# EAGLE design fireboy_yun (EAGLE 7.5.0)
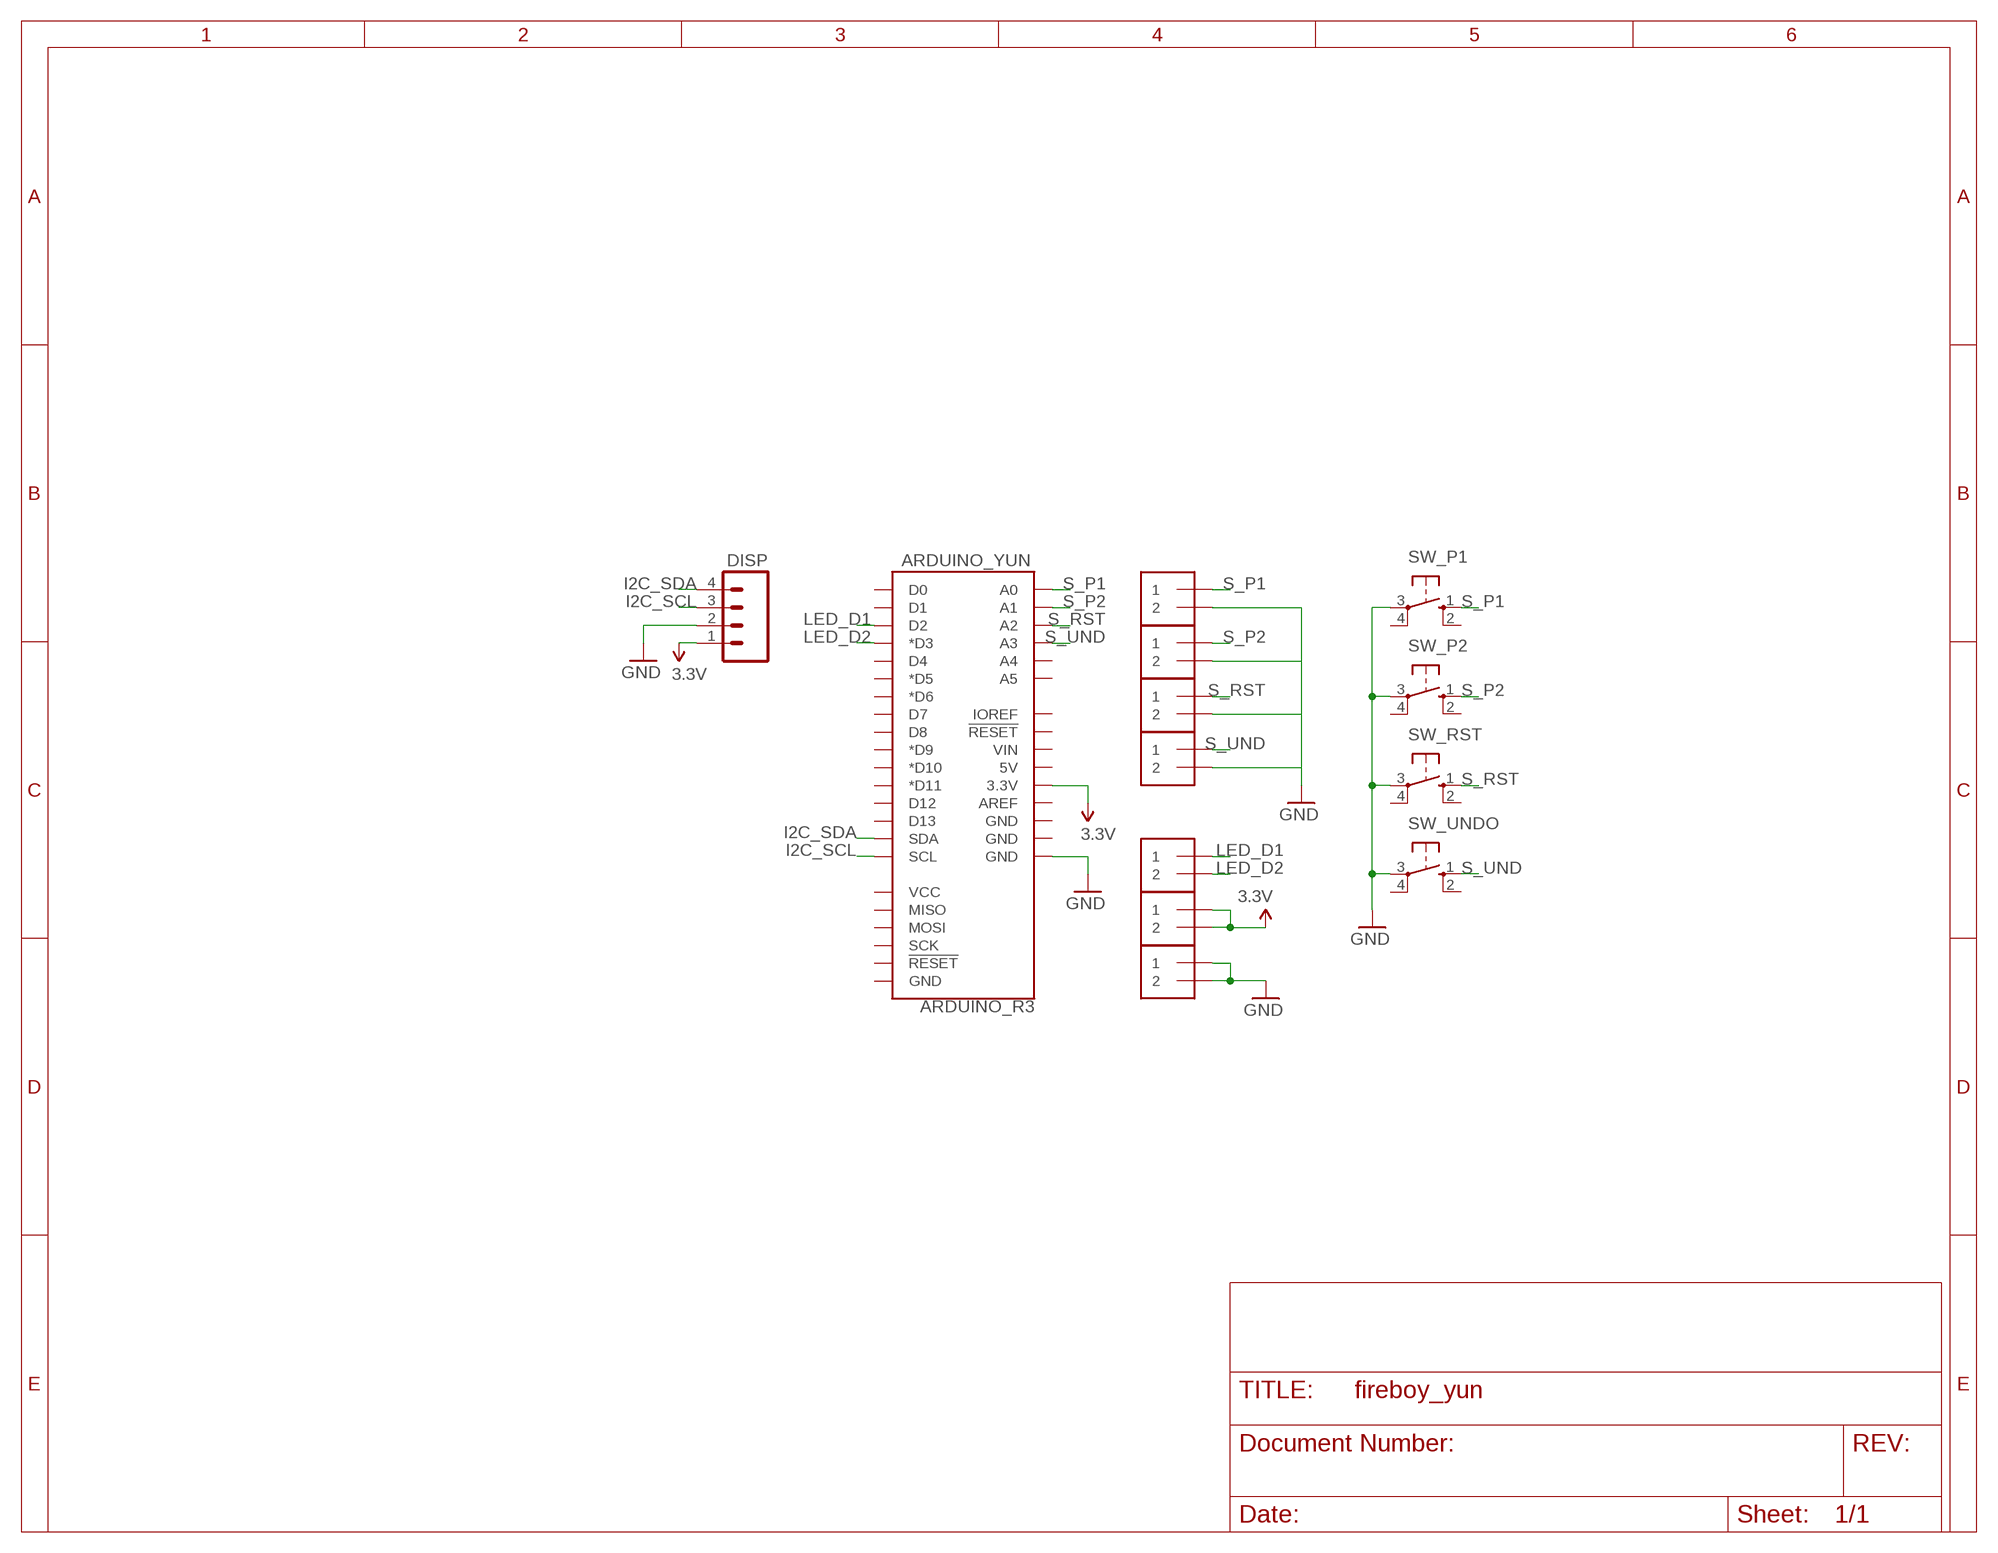
[diagram p0: schematic, sheet 1]

## Parts
ARDUINO_YUN  ARDUINO_R3  [ARDUINO_R3]
DISP  M04PTH  [1X04]
LED_3.3V  1X2-3.5MM  [1X2-3.5MM]
LED_DATA  1X2-3.5MM  [1X2-3.5MM]
LED_GND  1X2-3.5MM  [1X2-3.5MM]
S_P1  1X2-3.5MM  [1X2-3.5MM]
S_P2  1X2-3.5MM  [1X2-3.5MM]
S_RST  1X2-3.5MM  [1X2-3.5MM]
S_UND  1X2-3.5MM  [1X2-3.5MM]
SW_P1  40-XX  [B3F-40XX]
SW_P2  40-XX  [B3F-40XX]
SW_RST  40-XX  [B3F-40XX]
SW_UNDO  40-XX  [B3F-40XX]

## Nets
3.3V: ARDUINO_YUN.3.3V DISP.1 LED_3.3V.1 LED_3.3V.2
GND: ARDUINO_YUN.GND@2(GND) DISP.2 LED_GND.1 LED_GND.2 S_P1.2 SW_P1.3(P) SW_P2.3(P) SW_RST.3(P) SW_UNDO.3(P)
I2C_SCL: ARDUINO_YUN.SCL DISP.3
I2C_SDA: ARDUINO_YUN.SDA DISP.4
LED_D1: ARDUINO_YUN.D2 LED_DATA.1
LED_D2: ARDUINO_YUN.D3(*D3) LED_DATA.2
N$2: S_P2.2
N$3: S_RST.2
N$4: S_UND.2
S_P1: ARDUINO_YUN.A0 S_P1.1 SW_P1.1(S)
S_P2: ARDUINO_YUN.A1 S_P2.1
S_RST: ARDUINO_YUN.A2 S_RST.1
S_UND: ARDUINO_YUN.A3 S_UND.1
Unconnected: ARDUINO_YUN.5V ARDUINO_YUN.A4 ARDUINO_YUN.A5 ARDUINO_YUN.AREF ARDUINO_YUN.D0 ARDUINO_YUN.D1 ARDUINO_YUN.D4 ARDUINO_YUN.D5(*D5) ARDUINO_YUN.D6(*D6) ARDUINO_YUN.D7 ARDUINO_YUN.D8 ARDUINO_YUN.D9(*D9) ARDUINO_YUN.D10(*D10) ARDUINO_YUN.D11(*D11) ARDUINO_YUN.D12 ARDUINO_YUN.D13 ARDUINO_YUN.GND@1(GND) ARDUINO_YUN.GND@3(GND) ARDUINO_YUN.GND@4(GND) ARDUINO_YUN.IOREF ARDUINO_YUN.MISO ARDUINO_YUN.MOSI ARDUINO_YUN.RESET@1(!RESET!) ARDUINO_YUN.RESET@2(!RESET!) ARDUINO_YUN.SCK ARDUINO_YUN.VCC ARDUINO_YUN.VIN SW_P1.2(S1) SW_P1.4(P1) SW_P2.1(S) SW_P2.2(S1) SW_P2.4(P1) SW_RST.1(S) SW_RST.2(S1) SW_RST.4(P1) SW_UNDO.1(S) SW_UNDO.2(S1) SW_UNDO.4(P1)

## Library data of the parts
ARDUINO_YUN = SparkFun-Boards:ARDUINO_R3: Arduino R3 Footprint (w/ SPI header)
DISP = SparkFun-Connectors:M04: Header 4 Standard 4-pin 0.1" header. Use with straight break away headers (SKU : PRT-00116), right angle break away headers (PRT-00553), swiss pins (PRT-00743), machine pins (PRT-00117), and female headers (PRT-00115). Molex polarized connector foot print use with SKU : PRT-08231 with associated crimp pins and housings. 1MM SMD Version SKU: PRT-10208; PROD_ID: CONN-09696
LED_3.3V LED_DATA LED_GND S_P1 S_P2 S_RST S_UND = adafruit:1X2: 3.5mm Terminal block http://www.ladyada.net/library/pcb/eaglelibrary.html
SW_P1 SW_P2 SW_RST SW_UNDO = adafruit:40-XX: OMRON SWITCH; MF: OMRON COMPONENTS USA; MPN: B3F-4000; OC_FARNELL: 176434; OC_NEWARK: 36K3105

## Board
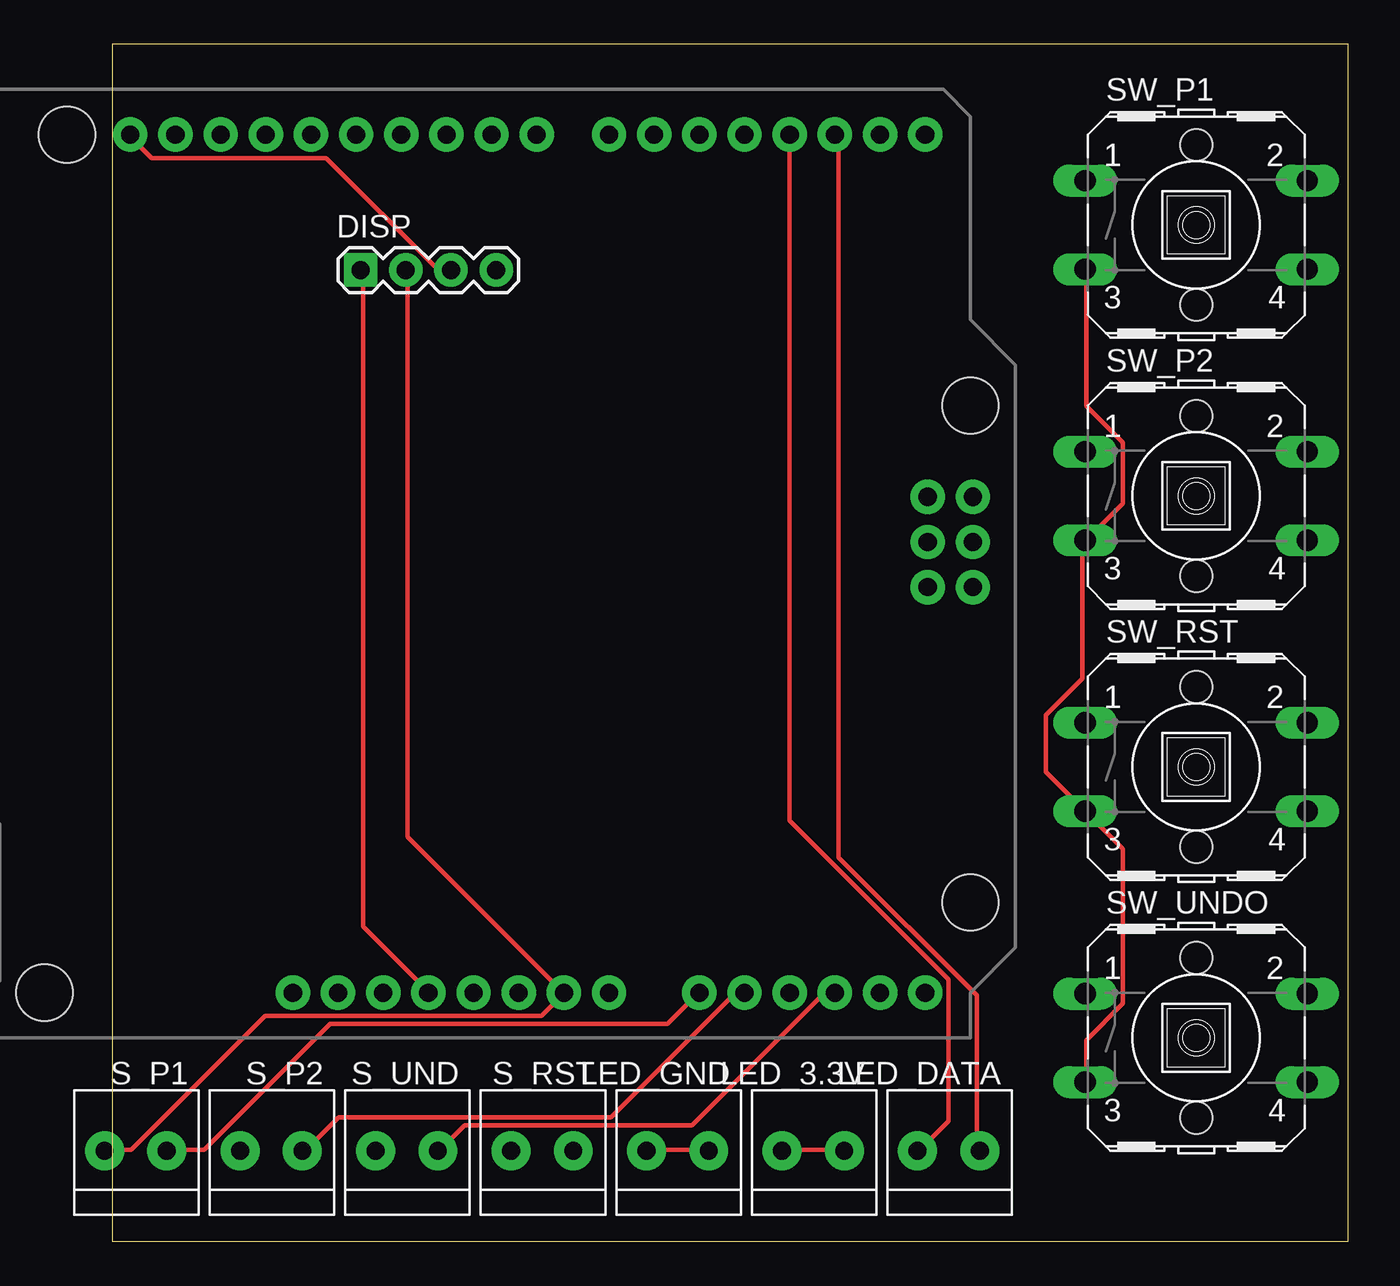
[diagram p1: board, top side]
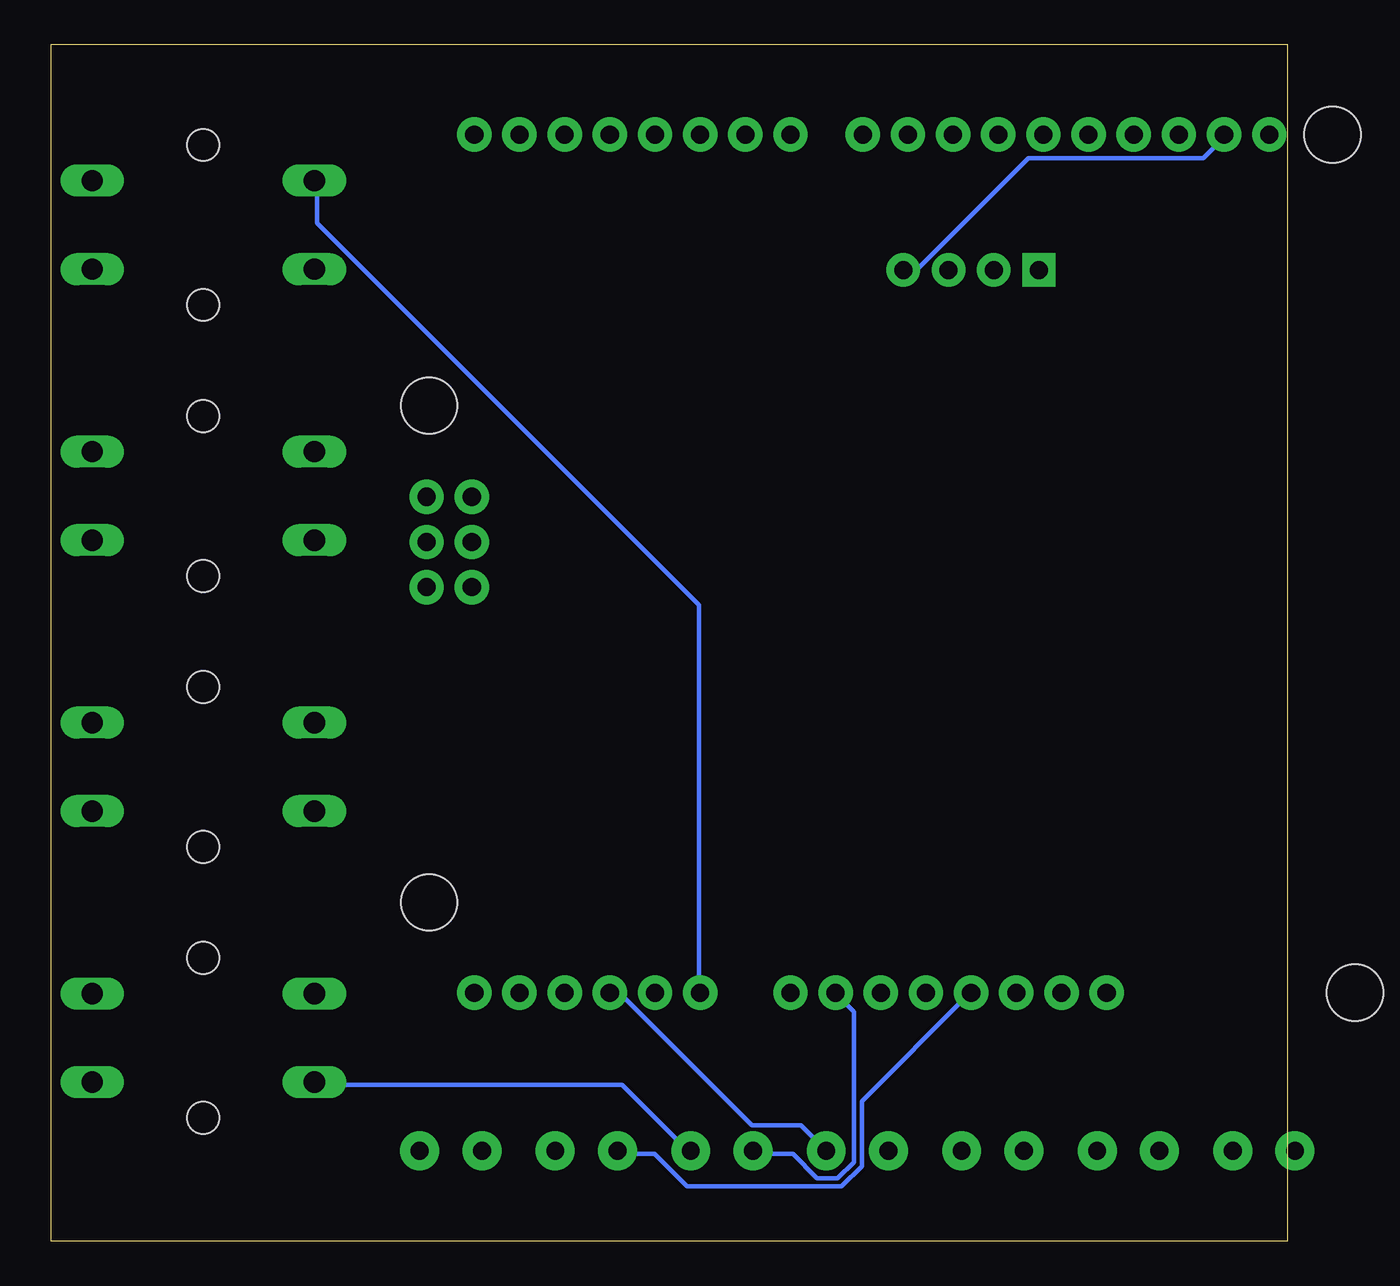
[diagram p2: board, bottom side, seen from below]

Size 69.52 x 67.3 mm. Coordinates in mm from the lower left corner, seen from the top.
Outline: 0,0 69.52,0 69.52,67.3 0,67.3 0,0
Copper layers (1*16): Top 0.035mm / dielectric 1.5mm / Bottom 0.035mm
Design rules "default": minimum track width 10mil, minimum drill 24mil, track to track 8mil, track to pad 8mil, pad to pad 8mil, via to via 8mil, smd to smd 8mil, copper to edge 40mil, drill to drill 8mil, minimum pad ring 10mil, minimum via ring 8mil, stop-mask expansion 4mil, vias tented up to drill 0mil, thermal gap 10mil

### Footprints (pad centres in the part's own frame; a part is rotated, then mirrored left to right if it is on the bottom)
ARDUINO_R3 = drill 1.016 pad 1.93: 3.3V 35.56,2.54; 5V 38.1,2.54; A0 50.8,2.54; A1 53.34,2.54; A2 55.88,2.54; A3 58.42,2.54; A4 60.96,2.54; A5 63.5,2.54; AREF 23.876,50.8; D0 63.5,50.8; D1 60.96,50.8; D2 58.42,50.8; D3 55.88,50.8; D4 53.34,50.8; D5 50.8,50.8; D6 48.26,50.8; D7 45.72,50.8; D8 41.656,50.8; D9 39.116,50.8; D10 36.576,50.8; D11 34.036,50.8; D12 31.496,50.8; D13 28.956,50.8; GND@1 40.64,2.54; GND@2 43.18,2.54; GND@3 26.416,50.8; GND@4 66.18,25.35; IOREF 30.48,2.54; MISO 63.64,30.43; MOSI 66.18,27.89; NC 27.94,2.54; RESET@1 33.02,2.54; RESET@2 63.64,25.35; SCK 63.64,27.89; SCL 18.796,50.8; SDA 21.336,50.8; VCC 66.18,30.43; VIN 45.72,2.54 | hole 3.175: 15.24,50.8; 66.04,35.56; 66.04,7.62; 13.97,2.54
1X04 = drill 1.016 pad 1.88 square: 1 0,0 | drill 1.016 pad 1.88: 2 2.54,0; 3 5.08,0; 4 7.62,0
1X2-3.5MM = drill 1 pad 2.184: 1 1.8,0; 2 -1.7,0
B3F-40XX = drill 1.194 long: 1 -6.248,2.489; 2 6.248,2.489; 3 -6.248,-2.489; 4 6.248,-2.489 | hole 1.803: 0,-4.496; 0,4.496

### Placement (x,y rotation side)
ARDUINO_YUN  -17.78,11.43 0 top
DISP  13.97,54.61 0 top
LED_3.3V  39.37,5.08 0 top
LED_DATA  46.99,5.08 0 top
LED_GND  31.75,5.08 0 top
S_P1  1.27,5.08 0 top
S_P2  8.89,5.08 0 top
S_RST  24.13,5.08 0 top
S_UND  16.51,5.08 0 top
SW_P1  60.96,57.15 0 top
SW_P2  60.96,41.91 0 top
SW_RST  60.96,26.67 0 top
SW_UNDO  60.96,11.43 0 top

### Tracks (layer width: path | path; a pad name or v marks a point on that pad's centre or on a via)
3.3V
  Top 0.254: LED_3.3V.2 37.87,5.13 41.07,5.13 LED_3.3V.1 | DISP.1 14.1,54.51 14.1,17.7 17.75,14.05 ARDUINO_YUN.3.3V
  Bottom 0.254: LED_3.3V.2 37.64,4.9 35.58,4.9 33.76,3.07 25.07,3.07 23.93,4.22 23.93,7.87 17.98,13.82 ARDUINO_YUN.3.3V
GND
  Top 0.254: SW_UNDO.3 54.79,9.02 54.79,11.3 56.84,13.36 56.84,22.05 SW_RST.3 52.5,26.39 52.5,29.59 54.56,31.65 54.56,39.42 SW_P2.3 54.79,39.42 56.84,41.48 56.84,44.91 54.79,46.97 54.79,54.51 SW_P1.3 | LED_GND.2 30.1,5.13 33.53,5.13 LED_GND.1 | DISP.2 16.61,54.51 16.61,22.73 25.3,14.05 ARDUINO_YUN.GND@2 25.3,13.82 24.15,12.68 8.61,12.68 1.07,5.13 -0.3,5.13 S_P1.2
  Bottom 0.254: LED_GND.2 29.87,4.9 27.81,4.9 26.44,3.53 25.3,3.53 24.38,4.45 24.38,12.9 25.3,13.82 ARDUINO_YUN.GND@2 | SW_UNDO.3 54.56,8.79 37.41,8.79 33.76,5.13 LED_GND.1
I2C_SCL
  Top 0.254: DISP.3 18.9,54.74 18.21,54.74 12.04,60.91 2.21,60.91 1.07,62.05 ARDUINO_YUN.SCL
I2C_SDA
  Bottom 0.254: DISP.4 21.41,54.74 20.73,54.74 14.55,60.91 4.72,60.91 3.58,62.05 ARDUINO_YUN.SDA
LED_D1
  Top 0.254: ARDUINO_YUN.D2 40.84,62.05 40.84,21.59 48.62,13.82 48.62,5.13 LED_DATA.1
LED_D2
  Top 0.254: ARDUINO_YUN.D3 38.1,23.65 47.02,14.73 47.02,6.73 45.41,5.13 LED_DATA.2
S_P1
  Top 0.254: S_P1.1 3.12,5.13 5.18,5.13 12.27,12.22 31.24,12.22 32.84,13.82 ARDUINO_YUN.A0
  Bottom 0.254: SW_P1.1 54.56,59.54 54.56,57.25 33.07,35.76 33.07,14.05 ARDUINO_YUN.A0
S_P2
  Top 0.254: ARDUINO_YUN.A1 35.36,13.82 34.9,13.82 28.04,6.96 12.72,6.96 10.9,5.13 S_P2.1
S_RST
  Bottom 0.254: ARDUINO_YUN.A2 38.1,13.82 37.41,13.82 30.1,6.5 27.36,6.5 25.98,5.13 S_RST.1
S_UND
  Top 0.254: ARDUINO_YUN.A3 40.61,13.82 39.93,13.82 32.61,6.5 19.81,6.5 18.44,5.13 S_UND.1